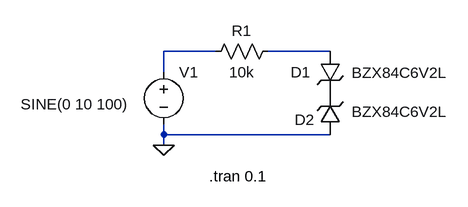
[diagram p0: schematic voltage_limiter_zener.asc]
voltage_limiter_zener.asc, the LTspice schematic file:
Version 4
SHEET 1 880 680
WIRE 320 80 240 80
WIRE 496 80 400 80
WIRE 240 112 240 80
WIRE 240 208 240 192
WIRE 496 208 240 208
WIRE 240 224 240 208
FLAG 240 224 0
SYMBOL zener 480 80 R0
WINDOW 0 -45 32 Left 2
WINDOW 3 49 33 Left 2
SYMATTR InstName D1
SYMATTR Value BZX84C6V2L
SYMBOL zener 512 208 R180
WINDOW 0 40 23 Left 2
WINDOW 3 -164 35 Left 2
SYMATTR InstName D2
SYMATTR Value BZX84C6V2L
SYMBOL voltage 240 96 R0
WINDOW 3 -220 65 Left 2
WINDOW 123 0 0 Left 0
WINDOW 39 0 0 Left 0
SYMATTR InstName V1
SYMATTR Value SINE(0 10 100)
SYMBOL res 416 64 R90
WINDOW 0 0 56 VBottom 2
WINDOW 3 32 56 VTop 2
SYMATTR InstName R1
SYMATTR Value 10k
TEXT 310 272 Left 2 !.tran 0.1

The netlist it stands for:
* voltage_limiter_zener.asc
D1 N002 P001 BZX84C6V2L
D2 0 P001 BZX84C6V2L
V1 N001 0 SINE(0 10 100)
R1 N002 N001 10k
.model D D
.lib standard.dio
.tran 0.1
.backanno
.end